# EAGLE design hail-met-v1 (EAGLE 7.1.0)
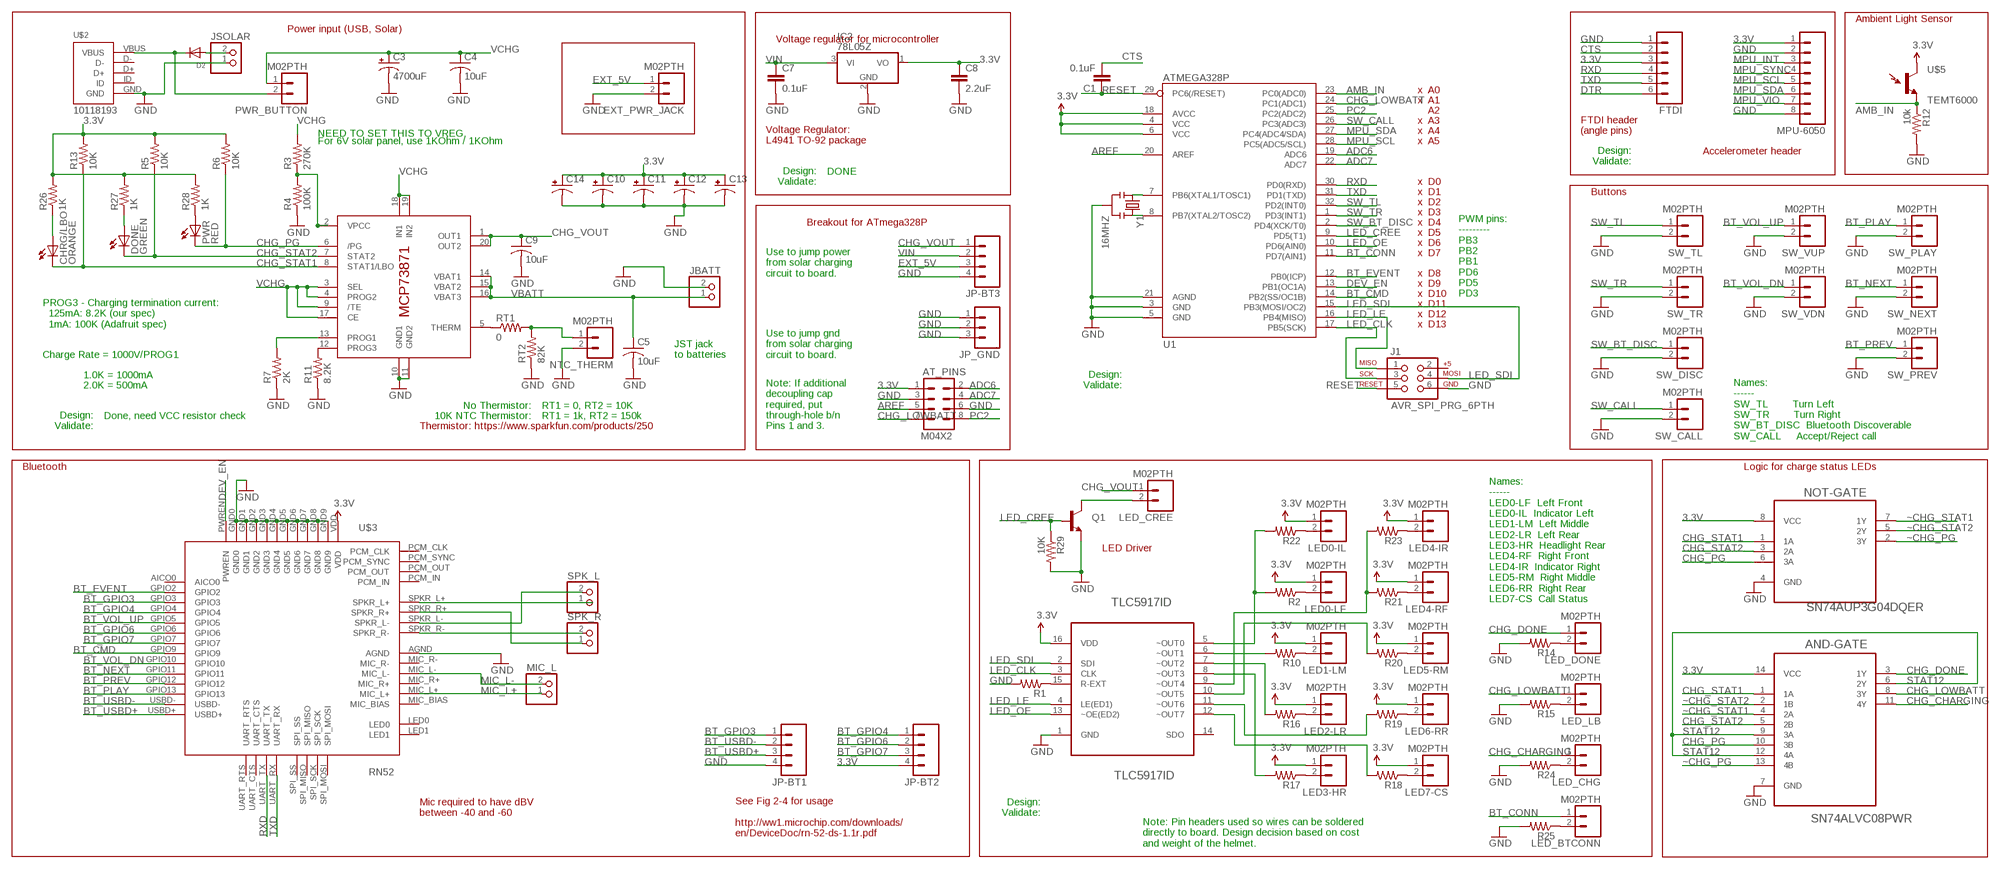
[diagram p0: schematic, sheet 1]

## Parts
AND-GATE  SN74ALVC08PWR  [SOP65P640X120-14N]
AT_PINS  M04X2  [2X4]
C1  0.1uF  CAP0805  [0805]
C3  4700uF  CPOL-USE5-13  [E5-13]
C4  10uF  C-USC0805K  [C0805K]
C5  10uF  C-USC0805K  [C0805K]
C7  0.1uF  CAP0805  [0805]
C8  2.2uF  CAP0805  [0805]
C9  10uF  C-USC0805K  [C0805K]
C10  CAP_POLPTH1  [CPOL-RADIAL-100UF-25V]
C11  CAP_POLPTH1  [CPOL-RADIAL-100UF-25V]
C12  CAP_POLPTH1  [CPOL-RADIAL-100UF-25V]
C13  CAP_POLPTH1  [CPOL-RADIAL-100UF-25V]
C14  CAP_POLPTH1  [CPOL-RADIAL-100UF-25V]
CHRG/LBO  ORANGE  LEDCHIP-LED0805  [CHIP-LED0805]
D2  DIODESOD-123  [SOD-123]
DONE  GREEN  LEDCHIP-LED0805  [CHIP-LED0805]
EXT_PWR_JACK  M02PTH  [1X02]
FTDI  M06LOCK  [1X06_LOCK]
IC1  MCP73871  [QFN20]
IC2  78L05Z  [TO92]
J1  AVR_SPI_PRG_6PTH  [2X3]
JBATT  JST_2PIN-SMT  [JST-PH-2-SMT]
JP-BT1  M04LOCK  [1X04_LOCK]
JP-BT2  M04LOCK  [1X04_LOCK]
JP-BT3  M04LOCK  [1X04_LOCK]
JP_GND  M03LOCK  [1X03_LOCK]
JSOLAR  JST_2PIN-SMT  [JST-PH-2-SMT]
LED0-IL  M02PTH  [1X02]
LED0-LF  M02PTH  [1X02]
LED1-LM  M02PTH  [1X02]
LED2-LR  M02PTH  [1X02]
LED3-HR  M02PTH  [1X02]
LED4-IR  M02PTH  [1X02]
LED4-RF  M02PTH  [1X02]
LED5-RM  M02PTH  [1X02]
LED6-RR  M02PTH  [1X02]
LED7-CS  M02PTH  [1X02]
LED_BTCONN  M02PTH  [1X02]
LED_CHG  M02PTH  [1X02]
LED_CREE  M02PTH  [1X02]
LED_DONE  M02PTH  [1X02]
LED_LB  M02PTH  [1X02]
MIC_L  JST_2PIN-SMT  [JST-PH-2-SMT]
MPU-6050  M08LOCK  [1X08_LOCK]
NOT-GATE  SN74AUP3G04DQER  [SON35P100X140X40-8N]
NTC_THERM  M02PTH  [1X02]
PWR  RED  LEDCHIP-LED0805  [CHIP-LED0805]
PWR_BUTTON  M02PTH  [1X02]
Q1  TRANSISTOR_NPNSOT23-3  [SOT23-3]
R1  RESISTOR0805-RES  [0805]
R2  RESISTOR0805-RES  [0805]
R3  270K  RESISTOR0805-RES  [0805]
R4  100K  RESISTOR0805-RES  [0805]
R5  10K  RESISTOR0805-RES  [0805]
R6  10K  RESISTOR0805-RES  [0805]
R7  2K  RESISTOR0805-RES  [0805]
R10  RESISTOR0805-RES  [0805]
R11  8.2K  RESISTOR0805-RES  [0805]
R12  10k  RESISTOR0805-RES  [0805]
R13  10K  RESISTOR0805-RES  [0805]
R14  RESISTOR0805-RES  [0805]
R15  RESISTOR0805-RES  [0805]
R16  RESISTOR0805-RES  [0805]
R17  RESISTOR0805-RES  [0805]
R18  RESISTOR0805-RES  [0805]
R19  RESISTOR0805-RES  [0805]
R20  RESISTOR0805-RES  [0805]
R21  RESISTOR0805-RES  [0805]
R22  RESISTOR0805-RES  [0805]
R23  RESISTOR0805-RES  [0805]
R24  RESISTOR0805-RES  [0805]
R25  RESISTOR0805-RES  [0805]
R26  1K  RESISTOR0805-RES  [0805]
R27  1K  RESISTOR0805-RES  [0805]
R28  1K  RESISTOR0805-RES  [0805]
R29  10K  RESISTOR0805-RES  [0805]
RT1  0  RESISTOR0805-RES  [0805]
RT2  82K  RESISTOR0805-RES  [0805]
SPK_L  JST_2PIN-SMT  [JST-PH-2-SMT]
SPK_R  JST_2PIN-SMT  [JST-PH-2-SMT]
SW_CALL  M02PTH  [1X02]
SW_DISC  M02PTH  [1X02]
SW_NEXT  M02PTH  [1X02]
SW_PLAY  M02PTH  [1X02]
SW_PREV  M02PTH  [1X02]
SW_TL  M02PTH  [1X02]
SW_TR  M02PTH  [1X02]
SW_VDN  M02PTH  [1X02]
SW_VUP  M02PTH  [1X02]
TLC5917ID  TLC5917ID  [SOIC127P600X175-16N]
U1  ATMEGA328P  ATMEGA328_SMT  [TQFP32-08]
U$2  10118193  [10118193]
U$3  RN52  [RN52]
U$5  TEMT6000  [TEMT6000-SEN]
Y1  16MHZ  RESONATOR16MHZ  [RESONATOR-SMD]

## Nets
3.3V: AND-GATE.14(VCC) AT_PINS.1 C8.1 C10.1(+) C11.1(+) C12.1(+) C13.1(+) C14.1(+) FTDI.3 IC2.1(VO) JP-BT2.4 LED0-IL.1 LED0-LF.1 LED1-LM.1 LED2-LR.1 LED3-HR.1 LED4-IR.1 LED4-RF.1 LED5-RM.1 LED6-RR.1 LED7-CS.1 MPU-6050.1 NOT-GATE.8(VCC) R5.2 R6.2 R13.2 R26.2 R27.2 R28.2 TLC5917ID.16(VDD) U1.4(VCC) U1.6(VCC) U1.18(AVCC) U$3.VDD U$5.COLLECTOR(C1)
ADC6: AT_PINS.2 U1.19(ADC6)
ADC7: AT_PINS.4 U1.22(ADC7)
AMB_IN: R12.1 U1.23(PC0(ADC0)) U$5.EMITTER(E1)
AREF: AT_PINS.5 U1.20(AREF)
BT_CMD: U1.14(PB2(SS/OC1B)) U$3.GPIO9
BT_CONN: LED_BTCONN.1 U1.11(PD7(AIN1))
BT_EVENT: U1.12(PB0(ICP)) U$3.GPIO2
BT_GPIO3: JP-BT1.1 U$3.GPIO3
BT_GPIO4: JP-BT2.1 U$3.GPIO4
BT_GPIO6: JP-BT2.2 U$3.GPIO6
BT_GPIO7: JP-BT2.3 U$3.GPIO7
BT_NEXT: SW_NEXT.1 U$3.GPIO11
BT_PLAY: SW_PLAY.1 U$3.GPIO13
BT_PREV: SW_PREV.1 U$3.GPIO12
BT_USBD+: JP-BT1.3 U$3.USBD+
BT_USBD-: JP-BT1.2 U$3.USBD-
BT_VOL_DN: SW_VDN.1 U$3.GPIO10
BT_VOL_UP: SW_VUP.1 U$3.GPIO5
CHG_CHARGING: AND-GATE.11(4Y) LED_CHG.1
CHG_DONE: AND-GATE.3(1Y) LED_DONE.1
CHG_LOWBATT: AND-GATE.8(3Y) AT_PINS.7 LED_LB.1 U1.24(PC1(ADC1))
CHG_PG: AND-GATE.10(3B) IC1.6(/PG) NOT-GATE.6(3A) PWR.C R6.1
CHG_STAT1: AND-GATE.1(1A) CHRG/LBO.C IC1.8(STAT1/LBO) NOT-GATE.1(1A) R13.1
CHG_STAT2: AND-GATE.5(2B) DONE.C IC1.7(STAT2) NOT-GATE.3(2A) R5.1
CHG_VOUT: C9.1 IC1.1(OUT1) IC1.20(OUT2) JP-BT3.1 LED_CREE.1
CTS: C1.2 FTDI.2
DEV_EN: U1.13(PB1(OC1A)) U$3.PWREN
DTR: FTDI.6
EXT_5V: EXT_PWR_JACK.1 JP-BT3.3
GND: AND-GATE.7(GND) AT_PINS.3 AT_PINS.6 C3.- C4.2 C5.2 C7.2 C8.2 C9.2 C10.2(-) C11.2(-) C12.2(-) C13.2(-) C14.2(-) EXT_PWR_JACK.2 FTDI.1 IC1.10(GND1) IC1.11(GND2) IC2.2(GND) J1.6 JBATT.2 JP-BT1.4 JP-BT3.4 JP_GND.1 JP_GND.2 JP_GND.3 JSOLAR.1 MPU-6050.2 MPU-6050.8 NOT-GATE.4(GND) NTC_THERM.2 Q1.2(E) R1.2 R4.1 R7.1 R11.1 R12.2 R14.2 R15.2 R24.2 R25.2 R29.2 RT2.1 SW_CALL.2 SW_DISC.2 SW_NEXT.2 SW_PLAY.2 SW_PREV.2 SW_TL.2 SW_TR.2 SW_VDN.2 SW_VUP.2 TLC5917ID.1(GND) U1.3(GND) U1.5(GND) U1.21(AGND) U$2.GND U$3.AGND U$3.GND0 U$3.GND1 U$3.GND2 U$3.GND3 U$3.GND4 U$3.GND5 U$3.GND6 U$3.GND7 U$3.GND8 U$3.GND9 Y1.2
LED_CLK: J1.3 TLC5917ID.3(CLK) U1.17(PB5(SCK))
LED_CREE: Q1.1(B) R29.1 U1.9(PD5(T1))
LED_LE: J1.1 TLC5917ID.4(LE(ED1)) U1.16(PB4(MISO))
LED_OE: TLC5917ID.13(~OE(ED2)) U1.10(PD6(AIN0))
LED_SDI: J1.4 TLC5917ID.2(SDI) U1.15(PB3(MOSI/OC2))
MIC_L+: MIC_L.1 U$3.MIC_L+
MIC_L-: MIC_L.2 U$3.MIC_L-
MPU_INT: MPU-6050.3
MPU_SCL: MPU-6050.5 U1.28(PC5(ADC5/SCL))
MPU_SDA: MPU-6050.6 U1.27(PC4(ADC4/SDA))
MPU_SYNC: MPU-6050.4
MPU_VIO: MPU-6050.7
N$1: U1.7(PB6(XTAL1/TOSC1)) Y1.1
N$2: U1.8(PB7(XTAL2/TOSC2)) Y1.3
N$3: IC1.5(THERM) RT1.1
N$5: R2.2 R22.2 TLC5917ID.5(~OUT0)
N$6: R10.2 TLC5917ID.6(~OUT1)
N$7: R16.2 TLC5917ID.7(~OUT2)
N$8: R17.2 TLC5917ID.8(~OUT3)
N$9: R21.2 R23.2 TLC5917ID.9(~OUT4)
N$10: R20.2 TLC5917ID.10(~OUT5)
N$11: R19.2 TLC5917ID.11(~OUT6)
N$12: R18.2 TLC5917ID.12(~OUT7)
N$13: NTC_THERM.1 RT1.2 RT2.2
N$14: SPK_L.2 U$3.SPKR_L-
N$15: D2.A JSOLAR.2
N$16: LED_BTCONN.2 R25.1
N$17: IC1.2(VPCC) R3.1 R4.2
N$18: IC1.12(PROG3) R11.2
N$19: LED_CREE.2 Q1.3(C)
N$20: CHRG/LBO.A R26.1
N$21: DONE.A R27.1
N$22: LED_DONE.2 R14.1
N$23: PWR.A R28.1
N$24: LED_LB.2 R15.1
N$25: U$3.SPKR_L+
N$26: SPK_R.2 U$3.SPKR_R-
N$27: SPK_R.1 U$3.SPKR_R+
N$30: LED_CHG.2 R24.1
N$56: R1.1 TLC5917ID.15(R-EXT)
N$57: LED0-LF.2 R2.1
N$58: LED4-RF.2 R21.1
N$59: LED5-RM.2 R20.1
N$60: LED6-RR.2 R19.1
N$61: LED7-CS.2 R18.1
N$62: LED3-HR.2 R17.1
N$63: LED1-LM.2 R10.1
N$64: LED2-LR.2 R16.1
N$65: LED0-IL.2 R22.1
N$66: LED4-IR.2 R23.1
N$80: D2.C PWR_BUTTON.2 U$2.VBUS
PC2: AT_PINS.8 U1.25(PC2(ADC2))
PROG1: IC1.13(PROG1) R7.2
RESET: C1.1 J1.5 U1.29(PC6(/RESET))
RXD: FTDI.4 U1.30(PD0(RXD)) U$3.UART_TX
STAT12: AND-GATE.6(2Y) AND-GATE.9(3A) AND-GATE.12(4A)
SW_BT_DISC: SW_DISC.1 U1.2(PD4(XCK/T0))
SW_CALL: SW_CALL.1 U1.26(PC3(ADC3))
SW_TL: SW_TL.1 U1.32(PD2(INT0))
SW_TR: SW_TR.1 U1.1(PD3(INT1))
TXD: FTDI.5 U1.31(PD1(TXD)) U$3.UART_RX
VBATT: C5.1 IC1.14(VBAT1) IC1.15(VBAT2) IC1.16(VBAT3) JBATT.1
VCHG: C3.+ C4.1 IC1.3(SEL) IC1.4(PROG2) IC1.9(/TE) IC1.17(CE) IC1.18(IN1) IC1.19(IN2) PWR_BUTTON.1 R3.2
VIN: C7.1 IC2.3(VI) JP-BT3.2
~CHG_PG: AND-GATE.13(4B) NOT-GATE.2(3Y)
~CHG_STAT1: AND-GATE.4(2A) NOT-GATE.7(1Y)
~CHG_STAT2: AND-GATE.2(1B) NOT-GATE.5(2Y)
Unconnected: J1.2 SPK_L.1 TLC5917ID.14(SDO) U$2.D+ U$2.D- U$2.ID U$3.AICO0 U$3.LED0 U$3.LED1 U$3.MIC_BIAS U$3.MIC_R+ U$3.MIC_R- U$3.PCM_CLK U$3.PCM_IN U$3.PCM_OUT U$3.PCM_SYNC U$3.SPI_MISO U$3.SPI_MOSI U$3.SPI_SCK U$3.SPI_SS U$3.UART_CTS U$3.UART_RTS

## Notes on the sheet
- Ambient Light Sensor
- Power input (USB, Solar)
- Voltage regulator for microcontroller
- x | A0
- x | A1
- A2
- x | A3
- x | A4
- FTDI header
  (angle pins)
- NEED TO SET THIS TO VREG.
  For 6V solar panel, use 1KOhm / 1KOhm
- x | A5
- Voltage Regulator:
  L4941 TO-92 package
- Accelerometer header
- Design:
  Validate:
- DONE
- Design:
  Validate:
- x | D0
- x | D1 | Buttons
- x | D2
- x | D3
- Breakout for ATmega328P | x | D4
- x | D5
- x | D6
- x | D7
- Use to jump power
  from solar charging
  circuit to board.
- x | D8
- x | D9
- x | D10
- PWM pins:
  ---------
  PB3
  PB2
  PB1
  PD6
  PD5
  PD3
- x | D11
- x | D12
- PROG3 - Charging termination current: 
    125mA: 8.2K (our spec)
    1mA: 100K (Adafruit spec)
- x | D13
- Charge Rate = 1000V/PROG1
- JST jack
  to batteries
- Use to jump gnd
  from solar charging
  circuit to board.
- 1.0K = 1000mA
- 2.0K = 500mA
- Design:
  Validate:
- No Thermistor: | RT1 = 0, RT2 = 10K
- Done, need VCC resistor check | 10K NTC Thermistor: | RT1 = 1k, RT2 = 150k
- Design:
  Validate:
- Thermistor: https://www.sparkfun.com/products/250
- Note: If additional
  decoupling cap
  required, put
  through-hole b/n
  Pins 1 and 3.
- Names:
  ------
  SW_TL        Turn Left
  SW_TR        Turn Right
  SW_BT_DISC  Bluetooth Discoverable
  SW_CALL     Accept/Reject call
- Bluetooth | Logic for charge status LEDs
- LED Driver
- Names:
  ------
  LED0-LF  Left Front
  LED0-IL  Indicator Left
  LED1-LM  Left Middle
  LED2-LR  Left Rear
  LED3-HR  Headlight Rear
  LED4-RF  Right Front
  LED4-IR  Indicator Right
  LED5-RM  Right Middle
  LED6-RR  Right Rear
  LED7-CS  Call Status
- Mic required to have dBV
  between -40 and -60
- Design:
  Validate:
- See Fig 2-4 for usage
  
  http://ww1.microchip.com/downloads/
  en/DeviceDoc/rn-52-ds-1.1r.pdf
- Note: Pin headers used so wires can be soldered
  directly to board. Design decision based on cost
  and weight of the helmet.

## Library data of the parts
AND-GATE = Texas Instruments_By_element14_Batch_1:SN74ALVC08PWR: QUADRUPLE 2-INPUT POSITIVE-AND GATE; MPN: SN74ALVC08PWR; OC_FARNELL: 1607810; OC_NEWARK: 97B9367; PACKAGE: TSSOP-14; SUPPLIER: Texas Instruments
AT_PINS = SparkFun-Connectors:M04X2: .1" header, two rows of four.
C1 C7 C8 = SparkFun-Passives:CAP: Capacitor Standard 0603 ceramic capacitor, and 0.1" leaded capacitor.
C3 = rcl:CPOL-US: POLARIZED CAPACITOR, American symbol
C4 C9 = adafruit:C-US: CAPACITOR, American symbol
C5 = rcl:C-US: CAPACITOR, American symbol
C10-C14 = SparkFun-Capacitors:CAP_POL: Capacitor Polarized These are standard SMD and PTH capacitors. Normally 10uF, 47uF, and 100uF in electrolytic and tantalum varieties. Always verify the external diameter of the through hole cap, it varies with capacity, voltage, and manufacturer. The EIA devices should be standard.
CHRG/LBO DONE PWR = adafruit:LED: LED OSRAM: - CHIPLED LG R971, LG N971, LY N971, LG Q971, LY Q971, LO R971, LY R971 LH N974, LH R974 LS Q976, LO Q976, LY Q976 LO Q996 - Hyper CHIPLED LW Q18S LB Q993, LB Q99A, LB R99A - SideLED LS A670, LO A670, LY A670, LG A670, LP A670 LB A673, LV A673, LT A673, LW A673 LH A674 LY A675 LS A676, LA A676, LO A676, LY A676, LW A676 LS A679, LY A679, LG A679 - Hyper Micro SIDELED® LS Y876, LA Y876, LO Y876, LY Y876 LT Y87S - SmartLED LW L88C, LW L88S LB L89C, LB L89S, LG L890 LS L89K, LO L89K, LY L89K LS L896, LA L896, LO L896, LY L896 - TOPLED LS T670, LO T670, LY T670, LG T670, LP T670 LSG T670, LSP T670, LSY T670, LOP T670, LYG T670 LG T671, LOG T671, LSG T671 LB T673, LV T673, LT T673, LW T673 LH T674 LS T676, LA T676, LO T676, LY T676, LB T676, LH T676, LSB T676, LW T676 LB T67C, LV T67C, LT T67C, LS T67K, LO T67K, LY T67K, LW E67C LS E67B, LA E67B, LO E67B, LY E67B, LB E67C, LV E67C, LT E67C LW T67C LS T679, LY T679, LG T679 LS T770, LO T770, LY T770, LG T770, LP T770 LB T773, LV T773, LT T773, LW T773 LH T774 LS E675, LA E675, LY E675, LS T675 LS T776, LA T776, LO T776, LY T776, LB T776 LHGB T686 LT T68C, LB T68C - Hyper Mini TOPLED® LB M676 - Mini TOPLED Santana® LG M470 LS M47K, LO M47K, LY M47K Source: http://www.osram.convergy.de/
D2 = adafruit:DIODE: Diode SMADIODE - SMA Surface Mount Package 20V 1A Schottky Diode Digikey: 641-1014-6-ND DO-1N4148 - Through Hole Small Current Diode SOD-123 20V 1 A (.5mV Vf) Schottky Diode - Digikey: MBRX120TPMSCT-ND SOD-323 10V 570mA (.38mV Vf, 3ns) Schottky Diode - Digikey: ZLLS410CT-ND SOD-523 30V 30mA Schottky Diode (RB751S-40TE61) - Digikey: RB751S-40TE61CT-ND SOT23-R/W - SOT23 Package (R = Solder Paste/Reflow Ovens, W = Hand-Soldering) BAT54Film 40V 300mA - Digikey: 497-7162-1-ND
EXT_PWR_JACK LED0-IL LED0-LF LED1-LM LED2-LR LED3-HR LED4-IR LED4-RF LED5-RM LED6-RR LED7-CS LED_BTCONN LED_CHG LED_CREE LED_DONE LED_LB NTC_THERM PWR_BUTTON SW_CALL SW_DISC SW_NEXT SW_PLAY SW_PREV SW_TL SW_TR SW_VDN SW_VUP = SparkFun-Connectors:M02: Standard 2-pin 0.1" header. Use with - straight break away headers ( PRT-00116) - right angle break away headers (PRT-00553) - swiss pins (PRT-00743) - machine pins (PRT-00117) - female headers (PRT-00115) Molex polarized connector foot print use with: PRT-08233 with associated crimp pins and housings. 2.54_SCREWTERM for use with PRT-10571. 3.5mm Screw Terminal footprints for PRT-08084 5mm Screw Terminal footprints for use with PRT-08432
FTDI = SparkFun-Connectors:M06: Header 6 Standard 6-pin 0.1" header. Use with straight break away headers (SKU : PRT-00116), right angle break away headers (PRT-00553), swiss pins (PRT-00743), machine pins (PRT-00117), and female headers (PRT-00115). Molex polarized connector foot print use with SKU : PRT-08094 with associated crimp pins and housings. NOTES ON THE VARIANTS LOCK and LOCK_LONGPADS... This footprint was designed to help hold the alignment of a through-hole component (i.e. 6-pin header) while soldering it into place. You may notice that each hole has been shifted either up or down by 0.005 of an inch from it's more standard position (which is a perfectly straight line). This slight alteration caused the pins (the squares in the middle) to touch the edges of the holes. Because they are alternating, it causes a "brace" to hold the component in place. 0.005 has proven to be the perfect amount of "off-center" position when using our standard breakaway headers. Although looks a little odd when you look at the bare footprint, once you have a header in there, the alteration is very hard to notice. Also,if you push a header all the way into place, it is covered up entirely on the bottom side. This idea of altering the position of holes to aid alignment will be further integrated into the Sparkfun Library for other footprints. It can help hold any component with 3 or more connection pins.
IC1 = adafruit:MCP73871
IC2 = adafruit:78*: Positive VOLTAGE REGULATOR Added bigger pads to the TO-92 package
J1 = SparkFun-Connectors:AVR_SPI_PRG_6: AVR ISP 6 Pin This is the reduced ISP connector for AVR programming. Common on Arduino. This footprint will take up less PCB space and can be used with a 10-pin to 6-pin adapter such as SKU: BOB-08508 **Special note about "TEST_POINT" package. The stop mask is on the top side, so if you want your programming test points to be on the bottom of your board, make sure to place this package on the bottom side of the board. This also ensure that the orientation to program from the bottom side will be correct.
JBATT JSOLAR MIC_L SPK_L SPK_R = adafruit:JST_2PIN: JST 2-Pin Connectors of various flavors SMT-RA (S2B-PH-SM4) 4UConnector #17311 SMT (B2B-PH-SM4) THM-RA (S2B-PH) THM (B2B-PH)
JP-BT1-JP-BT3 = SparkFun-Connectors:M04: Header 4 Standard 4-pin 0.1" header. Use with straight break away headers (SKU : PRT-00116), right angle break away headers (PRT-00553), swiss pins (PRT-00743), machine pins (PRT-00117), and female headers (PRT-00115). Molex polarized connector foot print use with SKU : PRT-08231 with associated crimp pins and housings. 1MM SMD Version SKU: PRT-10208
JP_GND = SparkFun-Connectors:M03: Header 3 Standard 3-pin 0.1" header. Use with straight break away headers (SKU : PRT-00116), right angle break away headers (PRT-00553), swiss pins (PRT-00743), machine pins (PRT-00117), and female headers (PRT-00115). Molex polarized connector foot print use with SKU : PRT-08232 with associated crimp pins and housings.
MPU-6050 = SparkFun-Connectors:M08: Header 8 Standard 8-pin 0.1" header. Use with straight break away headers (SKU : PRT-00116), right angle break away headers (PRT-00553), swiss pins (PRT-00743), machine pins (PRT-00117), and female headers (PRT-00115).
NOT-GATE = Texas Instruments_By_element14_Batch_1:SN74AUP3G04DQER: LOW-POWER TRIPLE INVERTER GATE; MPN: SN74AUP3G04DQER; OC_FARNELL: -; OC_NEWARK: 64R0603; PACKAGE: SON-8; SUPPLIER: Texas Instruments
Q1 = SparkFun:TRANSISTOR_NPN: Transistor NPN BJT configuration in SOT23 package. MMBT2222 is the common NPN we use. Double check BCE configuration again layout.
R1-R7 R10-R29 RT1 RT2 = SparkFun-Passives:RESISTOR: Resistor Basic schematic elements and footprints for 0603, 1206, and PTH resistors.
TLC5917ID = Texas Instruments_By_element14_Batch_1:TLC5917ID: 8-CHANNEL CONSTANT-CURRENT LED SINK DRIVERS; MPN: TLC5917ID; OC_FARNELL: 1755251; OC_NEWARK: 50M9008; PACKAGE: SOIC-16; SUPPLIER: Texas Instruments
U1 = SparkFun-DigitalIC:ATMEGA328_SMT: 32-Pin Atmega328 part Commonly used on Arduino compatible boards Available in QFP and QFN packages TQFP is IC-09069 QFN is non-stock; PROD_ID: IC-09069
U$2 = MicroUSB:10118193: Micro USB B Jack for Surface Mount; MPN: 10118193; OC_DIGIKEY: 609-4616-1-ND; WEBSITE: http://www.digikey.com/product-detail/en/10118193-0001LF/609-4616-1-ND/2785380
U$3 = RN52:RN52: RN-52 Bluetooth Module; DIGIKEY_OC: RN52-I/RM-ND
U$5 = SparkFun:TEMT6000: Ambient Light Sensor Simple light detection sensor. Output varies with light intensity input. Spark Fun Electronics SKU : COM-08348
Y1 = SparkFun-FreqCtrl:RESONATOR: Resonator Small SMD resonator. Used, eg, on the Arduino Pro/ Pro Mini boards. 8MHz- XTAL-08895 16MHz- XTAL-08900; PROD_ID: XTAL-08900

## Board
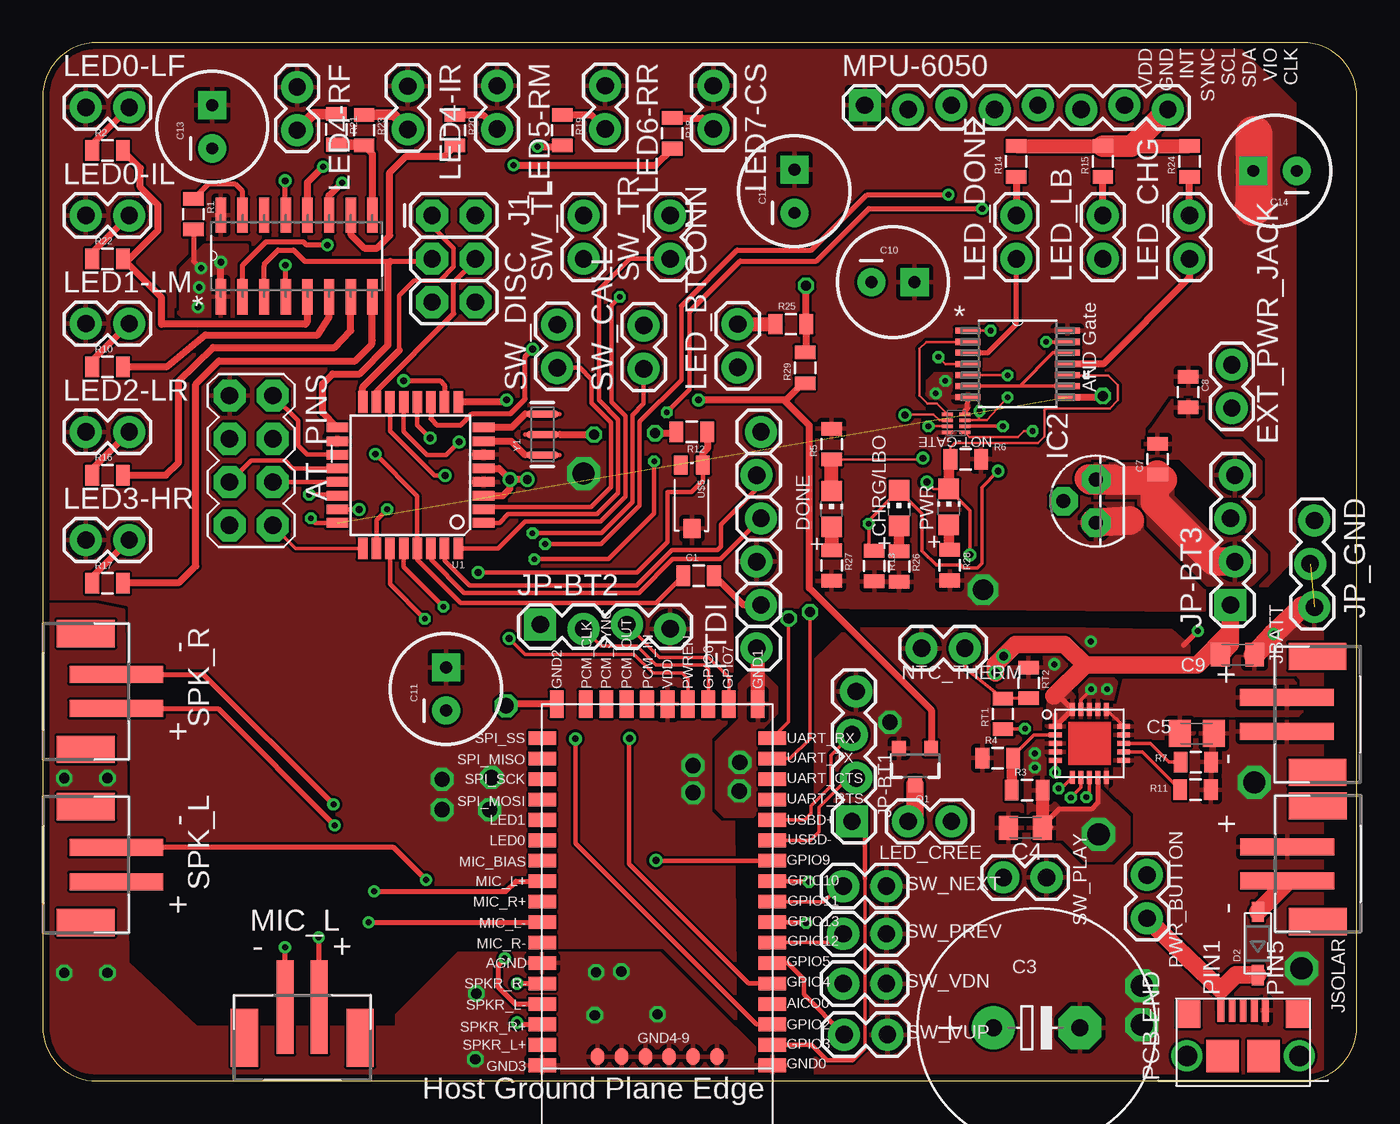
[diagram p1: board, top side]
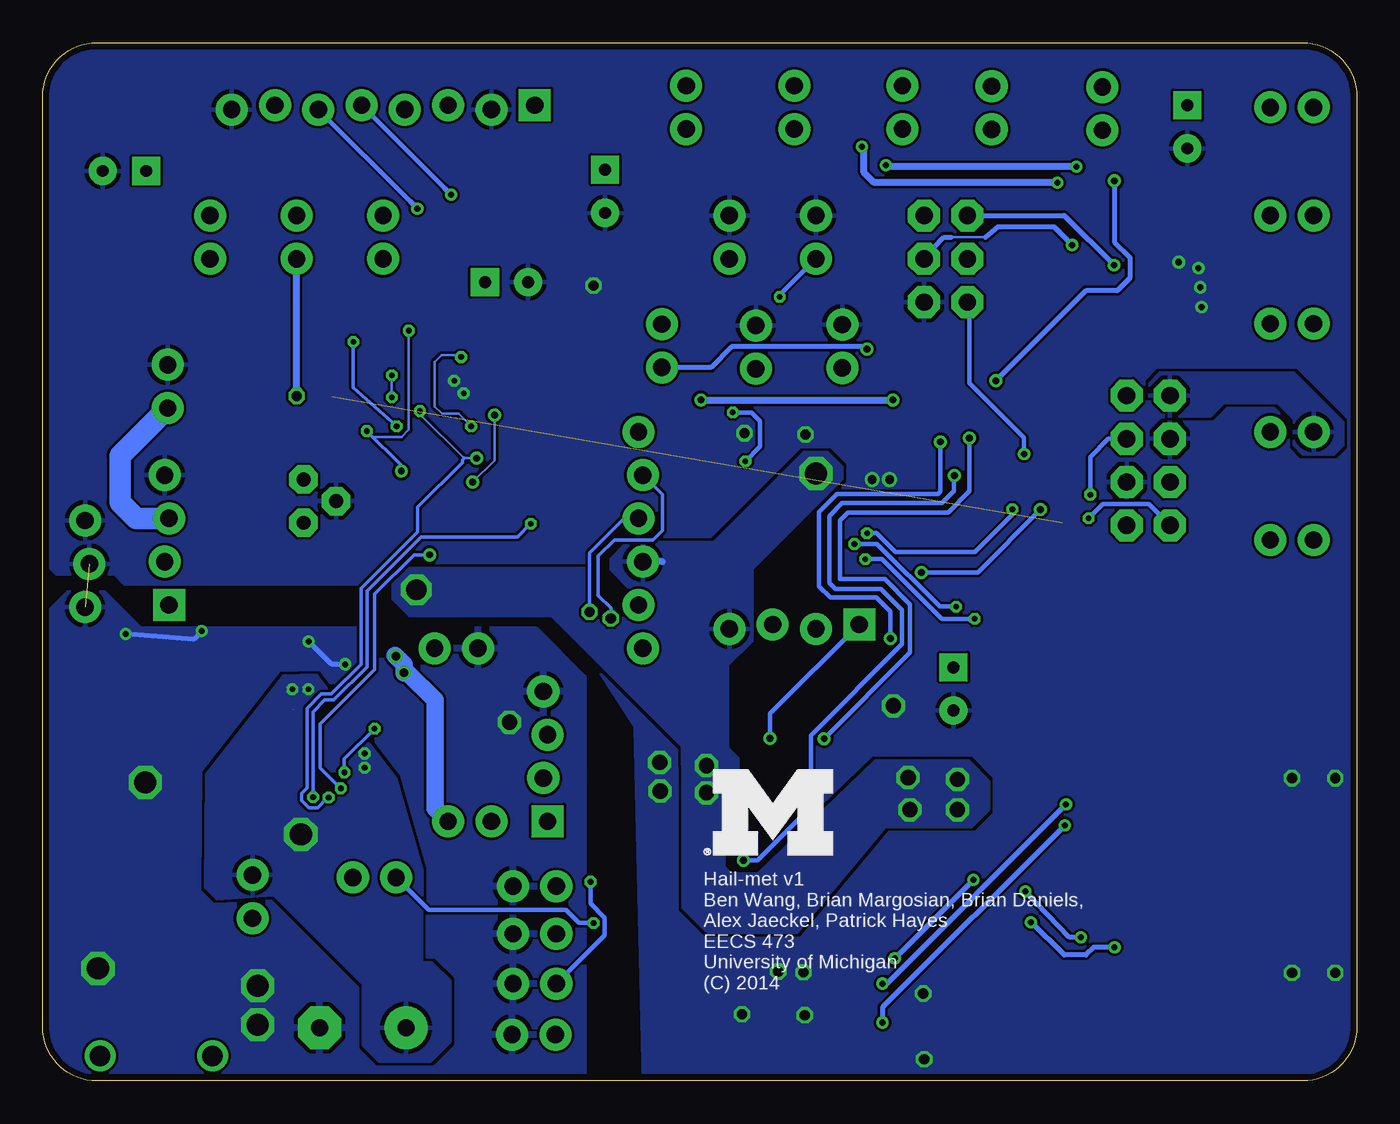
[diagram p2: board, bottom side, seen from below]

Size 77.14 x 60.95 mm. Coordinates in mm from the lower left corner, seen from the top.
Outline: 0,57.77 0,3.17 arc90 3.17,0 73.97,0 arc90 77.14,3.17 77.14,57.77 arc90 73.97,60.95 3.17,60.95 arc90 0,57.77
Copper layers (1*16): Top 0.0356mm / dielectric 1.5011mm / Bottom 0.0356mm
Design rules "LaenPCBOrder *": minimum track width 6mil, minimum drill 13mil, track to track 6mil, track to pad 6mil, pad to pad 6mil, via to via 6mil, smd to smd 6mil, copper to edge 15mil, drill to drill 6mil, minimum pad ring 7mil, minimum via ring 7mil, stop-mask expansion 3mil, vias tented up to drill 0mil, thermal gap 10mil

### Footprints (pad centres in the part's own frame; a part is rotated, then mirrored left to right if it is on the bottom)
SOP65P640X120-14N = smd 1.473 x 0.356: 1 -2.921,1.956; 2 -2.921,1.295; 3 -2.921,0.66; 4 -2.921,0; 5 -2.921,-0.66; 6 -2.921,-1.295; 7 -2.921,-1.956; 8 2.921,-1.956; 9 2.921,-1.295; 10 2.921,-0.66; 11 2.921,0; 12 2.921,0.66; 13 2.921,1.295; 14 2.921,1.956
2X4 = drill 1.016 pad 1.88 octagon: 1 -3.81,-1.27; 2 -3.81,1.27; 3 -1.27,-1.27; 4 -1.27,1.27; 5 1.27,-1.27; 6 1.27,1.27; 7 3.81,-1.27; 8 3.81,1.27
0805 = smd 0.8 x 1.2: 1 -0.9,0; 2 0.9,0
E5-13 = drill 1.016 pad 2.54: + -2.54,0 | drill 1.016 pad 2.54 octagon: - 2.54,0
C0805K = smd 1.1 x 1.4: 1 -1,0; 2 1,0
C0805K' = smd 1.3 x 1.6: 1 -1,0; 2 1,0
CPOL-RADIAL-100UF-25V = drill 0.7 pad 1.651 square: 1 1.27,0 | drill 0.7 pad 1.651: 2 -1.27,0
CHIP-LED0805 = smd 1.2 x 1.2: A 0,-1.05; C 0,1.05
SOD-123 = smd 1.2 x 0.7: A 1.85,0; C -1.85,0
1X02 = drill 1.016 pad 1.88: 1 0,0; 2 2.54,0
1X06_LOCK = drill 1.016 pad 1.88: 1 0,0; 2 2.54,-0.254; 3 5.08,0; 4 7.62,-0.254; 5 10.16,0; 6 12.7,-0.254
QFN20 = smd 0.75 x 0.3: 1 -2,1; 2 -2,0.5; 3 -2,0; 4 -2,-0.5; 5 -2,-1; 11 2,-1; 12 2,-0.5; 13 2,0; 14 2,0.5; 15 2,1 | smd 0.3 x 0.75: 6 -1,-2; 7 -0.5,-2; 8 0,-2; 9 0.5,-2; 10 1,-2; 16 1,2; 17 0.5,2; 18 0,2; 19 -0.5,2; 20 -1,2
TO92 = drill 0.813 pad 1.676 octagon: 1 -1.27,0; 2 0,1.905; 3 1.27,0
2X3 = drill 1.016 pad 1.88 octagon: 1 0,0; 2 0,2.54; 3 2.54,0; 4 2.54,2.54; 5 5.08,0; 6 5.08,2.54
JST-PH-2-SMT = smd 1 x 5.5: 1 -1,-1.8; 2 1,-1.8 | smd 1.6 x 3.4: NC1 -3.4,0; NC2 3.4,0
1X04_LOCK = drill 1.016 pad 1.88 square: 1 0,0.127 | drill 1.016 pad 1.88: 2 2.54,-0.127; 3 5.08,0.127; 4 7.62,-0.127
1X03_LOCK = drill 1.016 pad 1.88: 1 0,0.127; 2 2.54,-0.127; 3 5.08,0.127
1X08_LOCK = drill 1.016 pad 1.88 square: 1 0,0.127 | drill 1.016 pad 1.88: 2 2.54,-0.127; 3 5.08,0.127; 4 7.62,-0.127; 5 10.16,0.127; 6 12.7,-0.127; 7 15.24,0.127; 8 17.78,-0.127
SON35P100X140X40-8N = smd 0.66 x 0.203: 1 -0.508,0.533; 2 -0.508,0.178; 3 -0.508,-0.178; 4 -0.508,-0.533; 5 0.508,-0.533; 6 0.508,-0.178; 7 0.508,0.178; 8 0.508,0.533
SOT23-3 = smd 0.8 x 0.9: 1 -0.95,-1; 2 0.95,-1; 3 0,1.1
SOIC127P600X175-16N = smd 2.057 x 0.61: 1 -4.801,8.89; 2 -4.801,7.62; 3 -4.801,6.35; 4 -4.801,5.08; 5 -4.801,3.81; 6 -4.801,2.54; 7 -4.801,1.27; 8 -4.801,0; 9 0,0; 10 0,1.27; 11 0,2.54; 12 0,3.81; 13 0,5.08; 14 0,6.35; 15 0,7.62; 16 0,8.89
TQFP32-08 = smd 1.27 x 0.559: 1 -4.293,2.8; 2 -4.293,2; 3 -4.293,1.2; 4 -4.293,0.4; 5 -4.293,-0.4; 6 -4.293,-1.2; 7 -4.293,-2; 8 -4.293,-2.8; 17 4.293,-2.8; 18 4.293,-2; 19 4.293,-1.2; 20 4.293,-0.4; 21 4.293,0.4; 22 4.293,1.2; 23 4.293,2; 24 4.293,2.8 | smd 0.559 x 1.27: 9 -2.8,-4.293; 10 -2,-4.293; 11 -1.2,-4.293; 12 -0.4,-4.293; 13 0.4,-4.293; 14 1.2,-4.293; 15 2,-4.293; 16 2.8,-4.293; 25 2.8,4.293; 26 2,4.293; 27 1.2,4.293; 28 0.4,4.293; 29 -0.4,4.293; 30 -1.2,4.293; 31 -2,4.293; 32 -2.8,4.293
10118193 = smd 0.4 x 1.35: D+ 0,2.675; D- -0.65,2.675; GND 1.3,2.675; ID 0.65,2.675; VBUS -1.3,2.675 | smd 1.4 x 1.6: P$6 -3.2,2.45; P$7 3.2,2.45 | smd 1.9 x 1.9: P$8 1.2,0; P$9 -1.2,0 | drill 1.2 pad 1.6: P$11 3.3,0; P$12 -3.3,0
RN52 = smd 1.6 x 0.8: AGND 13.5,15.2; AICO0 0,17.6; GND0 0,21.2; GND3 13.5,21.2; GPIO2 0,18.8; GPIO3 0,20; GPIO4 0,16.4; GPIO5 0,15.2; GPIO9 0,9.2; GPIO10 0,10.4; GPIO11 0,11.6; GPIO12 0,14; GPIO13 0,12.8; LED0 13.5,8; LED1 13.5,6.8; MIC_BIAS 13.5,9.2; MIC_L+ 13.5,10.4; MIC_L- 13.5,12.8; MIC_R+ 13.5,11.6; MIC_R- 13.5,14; SPI_MISO 13.5,3.2; SPI_MOSI 13.5,5.6; SPI_SCK 13.5,4.4; SPI_SS 13.5,2; SPKR_L+ 13.5,20; SPKR_L- 13.5,17.6; SPKR_R+ 13.5,18.8; SPKR_R- 13.5,16.4; UART_CTS 0,4.4; UART_RTS 0,5.6; UART_RX 0,2; UART_TX 0,3.2; USBD+ 0,6.8; USBD- 0,8 | smd 0.8 x 1.6: GND1 0.85,0; GND2 12.65,0; GPIO6 3.75,0; GPIO7 2.55,0; PCM_CLK 10.95,0; PCM_IN 7.35,0; PCM_OUT 8.55,0; PCM_SYNC 9.75,0; PWREN 4.95,0; VDD 6.15,0 | smd 0.8 x 1: GND4 3.25,20.7; GND5 4.65,20.7; GND6 6.05,20.7; GND7 7.45,20.7; GND8 8.85,20.7; GND9 10.25,20.7
TEMT6000-SEN = smd 1.1 x 0.8: BASE -1.87,-0.65; EMITTER -1.87,0.65 | smd 1.1 x 1: COLLECTOR 1.86,0.01
RESONATOR-SMD = smd 0.45 x 1.905: 1 -1.2,0; 2 0,0; 3 1.2,0

### Placement (x,y rotation side)
AND-GATE  57.23,42.09 0 top
AT_PINS  12.24,36.42 270 top
C1  38.51,29.67 0 top
C3  58.34,3.12 0 top
C4  57.68,14.86 180 top
C5  10uF  [C0805K']  67.74,20.4 0 top
C7  65.43,36.5 90 top
C8  67.23,40.44 270 top
C9  70.13,25.02 0 top
C10  49.91,46.89 0 top
C11  23.67,23.01 90 top
C12  44.12,52.22 90 top
C13  9.96,56.01 90 top
C14  72.34,53.42 180 top
CHRG/LBO  50.27,33.63 0 top
D2  71.32,8.08 90 top
DONE  46.3,33.58 0 top
EXT_PWR_JACK  69.8,39.5 90 top
FTDI  41.91,25.4 90 top
IC1  61.44,19.81 0 top
IC2  61.82,34.04 90 top
J1  22.86,50.8 270 top
JBATT  74.83,21.51 270 top
JP-BT1  47.62,15.24 90 top
JP-BT2  29.21,26.67 0 top
JP-BT3  69.85,27.94 90 top
JP_GND  74.52,32.89 270 top
JSOLAR  74.85,12.75 270 top
LED0-IL  2.54,50.8 0 top
LED0-LF  2.54,57.15 0 top
LED1-LM  2.54,44.45 0 top
LED2-LR  2.54,38.1 0 top
LED3-HR  2.54,31.75 0 top
LED4-IR  21.44,58.39 270 top
LED4-RF  14.94,58.34 270 top
LED5-RM  26.67,58.42 270 top
LED6-RR  33.02,58.42 270 top
LED7-CS  39.37,58.42 270 top
LED_BTCONN  40.79,41.88 90 top
LED_CHG  67.31,48.26 90 top
LED_CREE  53.34,15.24 180 top
LED_DONE  57.15,48.26 90 top
LED_LB  62.23,48.26 90 top
MIC_L  15.24,2.54 180 top
MPU-6050  48.26,57.15 0 top
NOT-GATE  53.62,38.61 180 top
NTC_THERM  54.13,25.4 180 top
PWR  53.19,33.71 0 top
PWR_BUTTON  64.82,12.09 270 top
Q1  51.21,18.52 180 top
R1  8.86,50.88 270 top
R2  3.81,54.61 0 top
R3  57.78,17.07 0 top
R4  56.06,18.95 0 top
R5  46.3,37.39 90 top
R6  54.18,36.5 0 top
R7  67.69,18.72 180 top
R10  3.81,41.91 0 top
R11  67.67,17.09 180 top
R12  38.1,38.1 180 top
R13  48.82,30.23 270 top
R14  57.15,53.98 90 top
R15  62.23,53.98 90 top
R16  3.81,35.56 0 top
R17  3.81,29.21 0 top
R18  36.96,55.63 270 top
R19  30.51,55.8 270 top
R20  24.21,55.8 270 top
R21  17.25,55.85 270 top
R22  3.81,48.26 0 top
R23  18.87,55.8 270 top
R24  67.31,53.98 90 top
R25  43.92,44.42 0 top
R26  50.27,30.2 270 top
R27  46.3,30.25 270 top
R28  53.24,30.28 270 top
R29  44.75,41.86 90 top
RT1  56.36,21.54 90 top
RT2  57.86,23.37 270 top
SPK_L  2.54,12.7 90 top
SPK_R  2.54,22.86 90 top
SW_CALL  35.28,41.81 90 top
SW_DISC  30.2,41.86 90 top
SW_NEXT  46.99,11.43 0 top
SW_PLAY  56.39,11.94 0 top
SW_PREV  46.99,8.64 0 top
SW_TL  31.75,48.26 90 top
SW_TR  36.83,48.26 90 top
SW_VDN  46.99,5.71 0 top
SW_VUP  47.04,2.72 0 top
TLC5917ID  19.35,50.83 90 top
U1  21.59,35.56 180 top
U$2  70.46,1.47 0 top
U$3  42.82,22.12 180 top
U$5  38.1,34.29 270 top
Y1  29.34,37.95 90 top

### Tracks (layer width: path | path; a pad name or v marks a point on that pad's centre or on a via)
3.3V  (via drill 0.9, 1.2, 1.3)
  Top 1.676: 61.75,32.79 63.8,32.89
  Top 2.184: 71.09,55.55 71.09,51.33 71.04,51.28
  Bottom 0.406: 40.77,30.48 FTDI.3
  other vias: 23.44,17.7 26.24,15.93 38.18,18.52 38.18,16.92 23.44,15.93 26.34,17.81 31.75,35.66 55.19,28.83
  pour Top (rank 3): 40.41,27.89 68.15,27.64 68.4,60.88 -0.08,61.14 -0.08,-0.2 40.67,-0.2
  pour Bottom: 21.62,15.93 21.62,17.63 22.78,18.8 28.27,18.8 35.15,12.17 36.73,12.17 37.13,12.57 37.13,13.92 36.32,14.73 36.32,18.92 37.03,19.63 39.29,19.63 39.55,19.38 39.55,10.19 38.1,8.74 32.87,8.74 27.69,14.94 22.61,14.94
  pour Bottom: 8.61,39.04 11.56,39.04 12.17,39.65 12.17,40.94 11.56,41.55 3.71,41.55 0.84,38.68 0.84,37.31 1.35,36.8 3.17,36.8 3.68,37.31 3.68,38.86 4.65,39.83 7.8,39.83
  pour Bottom: 30.23,36.04 30.23,35.33 35.51,30.05 35.51,25.83 36.93,24.41 36.93,16.28 37.9,15.32 38.53,15.32 39.29,16.08 39.29,26.21 41.12,28.04 42.57,28.8 43.79,30.02 43.79,30.63 42.82,31.6 37.74,31.6 32.46,36.88 31.06,36.88
  pour Bottom: 55.88,29.92 56.59,29.21 56.59,28.27 55.63,27.3 47.29,27.3 39.6,19.61 39.6,18.62 38.66,17.68 37.62,17.68 37.19,18.11 37.19,19.84 38.51,21.16 38.51,25.55 43.05,30.1 55.68,30.1 55.7,30.1
  pour Top (rank 2): 67.28,61.24 69.67,61.24 73.53,57.38 73.53,30.68 71.91,29.06 60.4,29.06 58.98,27.64 58.98,58.62 61.54,61.19 61.59,61.24
ADC6
  Top 0.254: U1.19 15.51,36.76 14.99,37.29 14.99,38.76 AT_PINS.2
ADC7  (via drill 0.33)
  Top 0.254: v15.65,34.42 17.24,34.42 U1.22
  Bottom 0.254: AT_PINS.4 14.58,37.69 15.65,36.63 v15.65,34.42
AMB_IN  (via drill 0.41)
  Top 0.254: U1.23 v18.57,33.55 | v25.55,29.84 34.9,29.84 36.68,31.62 36.68,34.57 38.08,34.57 38.75,35.24 U$5.EMITTER
  Top 0.406: U$5.EMITTER 38.75,36.87 39.04,37.16 39.04,38.06 R12.1
  Bottom 0.254: v18.57,33.55 22.25,29.84 v25.55,29.84
AREF
  Top 0.254: U1.20 14.69,35.96 14.22,36.42 12.24,36.42 AT_PINS.5
BT_CMD  (via drill 0.41)
  Top 0.203: 36.02,12.92 v35.99,12.95
  Top 0.254: U$3.GPIO9 36.02,12.92 | v23.62,35.53 23.01,35.53 20.39,38.16 U1.14
  Bottom 0.203: 23.65,35.51 v23.62,35.53
  Bottom 0.254: v35.99,12.95 35.18,12.95 32.05,16.08 32.05,20.27 26.7,25.65 26.7,27.64 27.94,28.88 30.61,28.88 30.96,29.23 30.96,33.17 30.23,33.91 24.36,33.91 23.65,34.62 23.65,35.51
BT_CONN  (via drill 0.41)
  Top 0.305: U1.11 22.79,38.86 23.14,38.51 24.56,38.51 25.22,39.17 27.46,39.17 28.32,40.03 28.32,42.52 v28.75,42.95
  Bottom 0.305: v28.75,42.95 28.91,43.1 36.7,43.1 37.92,41.88 LED_BTCONN.1
BT_EVENT  (via drill 0.41)
  Top 0.254: v31.27,20.09 31.27,13.95 41.89,3.32 U$3.GPIO2 | v22.73,37.74 21.99,38.49 U1.12
  Bottom 0.203: 30.35,29.49 30.33,29.46
  Bottom 0.254: v31.27,20.09 26.24,25.15 26.24,27.96 27.71,29.46 30.33,29.46 | v22.73,37.74 22.73,34.62 23.98,33.38 29.87,33.38 30.35,32.89 30.35,29.49
BT_GPIO3
  Top 0.203: 48.23,1.93 48.26,1.96 48.26,11.86
  Top 0.254: JP-BT1.1 48.26,14.48 48.26,11.86 | U$3.GPIO3 45.12,2.12 46.02,1.22 47.52,1.22 48.23,1.93
BT_GPIO4  (via drill 0.41)
  Top 0.203: 34.42,20.09 v34.44,20.12
  Top 0.254: U$3.GPIO4 41.44,5.72 34.42,12.75 34.42,20.09
  Bottom 0.254: v34.44,20.12 34.44,21.57 JP-BT2.1
BT_GPIO6
  Top 0.203: U$3.GPIO6 39.07,24.17 38.84,24.41 35.99,24.41 34.87,25.53 32.77,25.53 JP-BT2.2
BT_GPIO7
  Top 0.203: U$3.GPIO7 40.27,23.68 39.09,24.87 36.22,24.87 JP-BT2.3
BT_NEXT
  Top 0.203: SW_NEXT.1 46.76,11.43 45.85,10.52 U$3.GPIO11
BT_PLAY  (via drill 0.33)
  Top 0.254: v44.81,9.27 44.75,9.32 U$3.GPIO13
  Bottom 0.254: v44.81,9.27 45.64,9.27 46.41,10.03 54.48,10.03 SW_PLAY.1
BT_PREV
  Top 0.203: SW_PREV.1 46.49,8.12 U$3.GPIO12
BT_USBD+
  Top 0.203: U$3.USBD+ 44.74,15.32 45.11,15.7 45.11,16.15 46.28,17.32 46.28,19.1 JP-BT1.3
BT_USBD-
  Top 0.203: JP-BT1.2 47.3,17.78 45.57,16.05 45.57,14.63 45.06,14.12 U$3.USBD-
BT_VOL_DN  (via drill 0.33)
  Top 0.254: v44.98,11.68 44.94,11.72 U$3.GPIO10
  Bottom 0.254: SW_VDN.1 44.15,8.56 44.15,9.58 44.98,10.41 v44.98,11.68
BT_VOL_UP
  Top 0.254: SW_VUP.1 44.68,5.08 44.68,5.97 43.72,6.92 U$3.GPIO5
CHG_CHARGING
  Top 0.406: LED_CHG.1 67.31,47.14 62.26,42.09 AND-GATE.11
CHG_DONE
  Top 0.305: AND-GATE.3 55.47,42.75 57.15,44.42 LED_DONE.1
CHG_LOWBATT  (via drill 0.33, 0.6)  (1 unrouted)
  Top 0.254: v15.75,33.02 16.01,32.76 U1.24
  Top 0.406: AND-GATE.8 62.15,40.13 v62.23,40.21
  Bottom 0.203: 12.27,33.86 12.22,33.86
  Bottom 0.254: v15.75,33.02 14.91,33.86 12.27,33.86 | 12.22,33.86 AT_PINS.7
  Bottom 0.406: v62.23,40.21 LED_LB.1
CHG_PG  (via drill 0.33, 0.41)
  Top 0.152: NOT-GATE.6 52.63,38.79 52.3,39.12 50.65,39.12 v50.62,39.09 | AND-GATE.10 60.17,41.4 62.56,41.4 63.12,40.84 63.12,39.95 62.64,39.47 58.9,39.47 58.8,39.37 58.8,37.82 58.42,37.44 53.52,37.44 53.28,37.2 R6.1 | v51.89,35.15 52.29,34.76 PWR.C
  Top 0.203: PWR.C 53.34,34.6 53.34,34.57 54.43,33.48 v54.43,30.89 | v59.64,17.17 59.8,17.17 IC1.6
  Top 0.61: R6.1 53.19,36.41 PWR.C
  Bottom 0.152: v50.62,39.09 50.62,36.42 v51.89,35.15
  Bottom 0.203: v54.43,30.89 55.35,30.89 57.66,28.57 57.66,24.16 60.86,20.95 60.86,18.39 v59.64,17.17
CHG_STAT1  (via drill 0.33, 0.41)
  Top 0.152: v58.12,38.15 57.61,38.15 57.25,37.8 54.41,37.8 NOT-GATE.1 | v55.65,44.04 AND-GATE.1
  Top 0.203: IC1.8 61.44,16.84 v61.27,16.66 | R13.1 48.49,31.46 v48.49,32.72 48.49,32.9 CHRG/LBO.C 50.27,34.65 51.61,33.3 51.61,31.11 52.45,30.28 53.9,30.28 54.05,30.12 54.86,30.12 55.12,30.38 55.12,34.82 v56.08,35.79
  Bottom 0.152: v58.12,38.15 57.76,37.8 56.08,37.8 55.65,38.23 v55.65,44.04
  Bottom 0.203: v61.27,16.66 61.27,21.67 60.58,22.35 60.05,22.35 58.09,24.31 58.09,28.75 54.91,31.93 49.28,31.93 v48.49,32.72 | v56.08,35.79 56.08,36.12 v58.12,38.15
CHG_STAT2  (via drill 0.33, 0.41)
  Top 0.152: AND-GATE.5 v56.64,41.43 | v56.64,40.13 55.42,38.79 54.94,38.79 | 54.94,38.79 NOT-GATE.3 | v51.66,36.55 51.6,36.49 R5.1 | v54.99,39.32 54.94,38.79
  Top 0.203: v60.35,16.64 60.94,17.23 IC1.7
  Top 0.813: DONE.C R5.1
  Bottom 0.152: v56.64,41.43 v56.64,40.13 | v51.66,36.55 52.4,36.55 54.94,39.09 v54.99,39.32
  Bottom 0.203: 52.4,36.55 52.5,36.45 52.5,36.3 55.12,33.68 55.12,32.23 58.45,28.91 58.45,24.46 60.2,22.71 60.78,22.71 61.62,21.87 61.62,17.2 61.92,16.89 61.92,16.46 61.49,16.03 61.01,16.03 60.4,16.64 v60.35,16.64
CHG_VOUT  (via drill 0.5)
  Top 0.203: 59.36,22.61 59.65,22.61
  Top 0.305: 59.65,22.61 IC1.20 IC1.1 | IC1.1 59.44,21.51
  Top 1.016: 61.19,24.41 67.77,24.41 69.72,26.39 JP-BT3.1 69.72,25.61 C9.1 | 61.19,24.41 59.36,22.61 | 61.19,24.41 59.97,25.63 57.1,25.63 v56.41,24.94 55.93,24.46 v55.93,23.95
  Bottom 1.016: LED_CREE.1 54.1,16 54.1,22.35 55.7,23.95 v55.93,23.95 55.93,24.46 56.44,24.97
  pour Top: 59.13,20.55 59.99,20.55 60.71,21.26 60.71,22.45 60.58,22.58 60.3,22.94 59.03,22.66 58.88,20.8
CTS
  Top 0.406: FTDI.2 41.13,27.94 C1.2
DEV_EN  (via drill 0.41)
  Top 0.203: U$3.PWREN 37.87,23.59 37.52,23.95 35.81,23.95 34.72,25.04 28.32,25.04 v27.38,25.98
  Top 0.254: U1.13 21.19,38.12 22.55,36.75 23.67,36.75 v24.43,37.52
  Bottom 0.254: v24.43,37.52 24.43,34.59 24.59,34.44 30.53,34.44 31.57,33.4 31.57,29.03 30.91,28.37 28.19,28.37 27.38,27.56 v27.38,25.98
EXT_5V
  Bottom 1.27: EXT_PWR_JACK.1 72.59,36.7 72.59,33.96 71.65,33.02 JP-BT3.3
GND  (via drill 0.33, 0.36, 0.41, 0.51, 0.6, 0.9, 1.3)  (1 unrouted)
  Top 0.152: AND-GATE.7 54.36,40.08 54.33,39.62 | NOT-GATE.4 54.13,39.32
  Top 0.254: AT_PINS.6 U1.21
  Top 0.305: 54.13,39.32 54.28,39.47 AND-GATE.7 | 66.97,25.59 v67.79,26.42 | R1.2 8.87,48.13 v9.3,47.7
  Top 0.406: 30.35,37.95 v32.36,37.95 | TLC5917ID.1 v10.46,48.06 | U1.3 27.02,34.36 27.43,34.77 v27.43,35.31 | U1.5 26.78,35.96 v27.43,35.31 | v28.45,35.31 v27.43,35.31 | v35.94,38.02 37.12,38.02 R12.2 | v44.81,46.69 44.82,46.67 R25.2 44.82,42.82 R29.2 | U$3.GND2 27.3,22.12 v27.2,22.02
  Top 0.813: U$3.GND1 41.97,25.34 FTDI.1 | R14.2 R15.2 R24.2
  Top 1.27: MPU-6050.8 63.89,54.88 R15.2 | C9.2 v72.27,26.23 73.92,27.81 JP_GND.3
  Bottom 0.305: v59.38,24.46 60.17,24.46 v61.52,25.81 | v67.79,26.42 68.28,25.93 v72.27,26.23
  other vias: 1.27,6.35 3.81,6.35 3.81,17.78 1.27,17.78 33.96,6.43 32.49,6.38 32.41,3.86 25.4,1.27 36.09,3.91 25.45,5.13 52.43,40.36 52.98,41.1 64.52,3.3 64.52,5.59 71.12,17.53 73.89,6.6 40.92,18.69 40.89,17.02 9.19,46.58 9.12,45.42 49.73,21.06
  pour Top (rank 3): 47.22,26.49 61.16,26.49 65.35,26.42 66.24,26.42 67.26,25.53 67.23,23.01 67.31,22.94 69.57,22.94 69.72,23.09 69.72,24.56 70.05,24.89 71.6,24.89 72.11,25.4 72.11,26.16 72.87,26.92 74.45,26.92 75.08,26.29 75.08,-0.41 45.39,-0.41 45.39,24.71 46.89,26.16
  pour Top: 43.64,1.52 42.14,1.57 40.59,3.12 9.02,3.12 4.98,6.91 4.72,27.61 3.12,27.94 -0.33,27.94 -0.33,-0.51 43.64,-0.28
  pour Bottom (rank 3): 72.24,29.18 72.24,61.14 -0.18,61.14 -0.18,-0.15 41.86,-0.15 42.37,20.83 47.24,28.37 54.91,28.37 55.45,29.18
  pour Top: 20.75,2.97 20.75,3.91 23.9,7.06 24.38,7.54 30.51,7.54 36.25,7.54 41.81,1.98 21.74,1.98
  pour Top: 53.8,41.17 53.42,41.55 52.35,41.55 51.89,41.1 51.87,39.75 52.17,39.45 54.43,39.45 54.46,40.44 54.28,40.59 53.8,40.59
  pour Bottom: 62.97,0.08 62.97,6.55 63.86,7.44 66.34,7.44 69.34,10.44 69.34,24.56 73.48,28.7 75.67,28.7 77.34,27.03 77.34,0.08
  pour Bottom: 72.06,29.18 72.34,29.18 72.9,29.74 76.33,29.74 77.52,30.94 77.52,61.14 72.06,61.14
  pour Top: 64.72,36.86 64.72,37.87 65.18,38.33 66.29,39.95 67.79,39.95 68.12,39.62 68.12,38.71 69.27,37.57 70.28,37.57 71.5,36.35 71.5,34.54 71.3,34.34 68.99,34.34 66.75,36.58 65,36.58
  pour Top: 42.29,23.93 41.5,23.93 41.22,23.65 40.89,23.32 40.89,21.23 39.55,19.89 39.55,16 40.03,15.52 41.71,15.52 42.19,16 42.19,20.68 43.08,21.56 43.08,22.94 43.08,23.14
  pour Top: 8,45.11 8.26,44.86 11.96,44.86 11.96,49.02 9.53,49.02 8.13,47.62 8.13,45.06 8.15,45.03 8.15,44.98 8.18,44.96
  pour Bottom (rank 4): 62.18,26.49 48.21,26.49 45.42,23.7 45.42,-0.13 48.49,-0.13 77.5,-0.13 77.5,24.23 77.5,26.49
LED_CLK
  Top 0.305: TLC5917ID.3 13.01,47.85 13.03,47.88 13.03,47.98 13.82,48.77 14.73,48.77 15.39,48.11 20.42,48.11 22.71,48.11 J1.3
  Top 0.406: U1.17 16.43,39.22 16.43,40.92 17.02,41.5 18.59,41.5 20.27,43.18 20.27,47.95 20.42,48.11
LED_CREE  (via drill 0.41)
  Top 0.406: 43.59,39.9 45.01,38.48 45.01,28.93 52.16,21.78 Q1.1 | 43.59,39.9 43.51,39.98 v38.51,39.98 | v27.23,39.98 27.1,39.85 U1.9 | R29.1 44.64,40.96 43.59,39.9
  Bottom 0.406: v38.51,39.98 v27.23,39.98
LED_LE  (via drill 0.36)
  Top 0.254: 20.93,42.88 20.93,46.1 21.82,46.99 23.32,46.99 24.13,47.8 24.13,48.9 22.86,50.16 J1.1
  Top 0.305: TLC5917ID.4 14.28,47.85
  Top 0.406: 14.28,47.85 v14.25,47.88 | U1.16 18.79,40.74 20.93,42.88
  Bottom 0.305: J1.1 17.17,50.8 v14.25,47.88
LED_OE  (via drill 0.41)
  Top 0.305: TLC5917ID.13 14.22,50.88 v14.22,52.83 | v21.18,41.1 23.32,41.1 23.59,40.82 U1.10
  Bottom 0.305: v14.22,52.83 14.22,49.25 13.34,48.36 13.34,47.12 14.07,46.38 15.9,46.38 v21.18,41.1
LED_SDI  (via drill 0.36)
  Top 0.305: TLC5917ID.2 11.73,47.88 13.11,49.25 15.32,49.25 15.49,49.07 v16.71,49.07 | U1.15 19.59,40.49 24.13,45.03 24.13,46.89 25.4,48.16 J1.4
  Bottom 0.152: 23.82,49.53 21.79,49.53
  Bottom 0.305: J1.4 25.4,48.28 24.23,49.53 23.82,49.53 | 21.79,49.53 21.08,50.14 17.78,50.14 v16.71,49.07
MIC_L+  (via drill 0.36)
  Top 0.305: MIC_L.1 16.24,8.4 v16.2,8.43 | 29.31,11.73 U$3.MIC_L+ 27.78,11.72 27.18,11.12 v19.46,11.12
  Bottom 0.305: v16.2,8.43 16.87,8.43 v19.46,11.12
MIC_L-  (via drill 0.36)
  Top 0.305: MIC_L.2 14.24,7.83 v14.22,7.85 | 29.27,9.27 U$3.MIC_L- v19.13,9.32
  Bottom 0.305: v14.22,7.85 15.44,7.85 15.9,7.39 17.17,7.39 19.1,9.32 v19.13,9.32
MPU_SCL  (via drill 0.33, 0.36)
  Top 0.254: U1.28 21.19,30.17 v23.52,27.84 | v29.49,31.52 32.77,31.52 35.03,33.78 35.03,38.71 37.49,41.15 37.49,45.49
  Top 0.305: 37.49,45.49 40.77,48.77 45.14,48.77 48.39,52.02 v53.16,52.02
  Bottom 0.254: v23.52,27.84 24.49,27.84 28.17,31.52 v29.49,31.52 | 53.54,52.4 MPU-6050.5
  Bottom 0.305: v53.16,52.02 53.54,52.4
MPU_SDA  (via drill 0.33, 0.36)
  Top 0.254: 37.97,45.16 37.97,40.59 v36.63,39.24 | v28.85,30.63 33.22,30.63 35.89,33.3 v35.89,36.37 | v22.43,27.13 20.39,29.16 U1.27
  Top 0.305: 37.97,45.16 40.95,48.13 45.41,48.13 48.49,51.21 v55.14,51.21
  Bottom 0.254: MPU-6050.6 55.54,51.6 | v28.85,30.63 27.86,30.63 24.36,27.13 v22.43,27.13 | v35.89,36.37 35.03,37.24 35.03,38.73 35.53,39.24 v36.63,39.24
  Bottom 0.305: v55.14,51.21 55.54,51.6
N$1
  Top 0.406: U1.7 27.51,37.56 28.32,36.75
N$2
  Top 0.406: 28.32,39.15 27.53,38.36 U1.8
N$3  (via drill 0.33)
  Top 0.203: IC1.5 59.44,18.24 v59.44,18.11 | v57.66,20.68 55.89,20.68 RT1.1
  Bottom 0.203: v59.44,18.11 59.44,18.9 v57.66,20.68
N$5
  Top 0.406: R2.2 5.74,53.58 5.74,52.45 6.78,51.41 6.78,49.94 5.11,48.26 R22.2 6.99,45.98 6.99,44.42 15.42,44.42 15.52,44.53 15.52,46 TLC5917ID.5
N$6
  Top 0.406: R10.2 4.74,41.94 7.32,41.94 9.55,43.79 16.15,43.79 16.82,44.83 TLC5917ID.6
N$7
  Top 0.406: R16.2 7.24,35.56 7.98,36.3 7.98,41.07 10.01,43.05 17.14,43.05 18.09,44.04 TLC5917ID.7
N$8
  Top 0.406: R17.2 4.76,29.26 8.03,29.26 8.99,30.23 8.99,40.89 10.31,42.22 10.31,42.24 10.34,42.27 18.34,42.27 19.33,43.26 19.33,43.46 19.36,43.48 TLC5917ID.8
N$9
  Top 0.406: R23.2 19.36,54.42 TLC5917ID.9
  Top 0.61: R21.2 18.82,54.95 R23.2
N$10
  Top 0.406: TLC5917ID.10 18.09,49.68 18.87,48.9 19.63,48.9 20.37,49.63 20.37,53.31 21.34,54.28 23.58,54.28 R20.2
N$11  (via drill 0.36)
  Top 0.406: TLC5917ID.11 16.82,51.97 v17.58,52.73 | v29.06,54.84 30.44,54.84 R19.2
  Bottom 0.406: v17.58,52.73 28.35,52.73 28.93,53.31 28.93,54.71 v29.06,54.84
N$12  (via drill 0.36)
  Top 0.406: TLC5917ID.12 15.54,52.76 v16.46,53.67 | v27.64,53.75 35.98,53.75 R18.2
  Bottom 0.406: v16.46,53.67 27.56,53.67 v27.64,53.75
N$13
  Top 0.203: NTC_THERM.1 54.13,24.24 RT1.2 57.28,22.49 RT2.2
N$14  (via drill 0.36)
  Top 0.305: v27.13,7.19 26.72,6.78 26.72,5.54 27.73,4.52 U$3.SPKR_L- | v22.5,11.81 20.61,13.7 SPK_L.2
  Bottom 0.305: v22.5,11.81 v27.13,7.19
N$15
  Top 1.016: JSOLAR.2 73.05,11.66 D2.A
N$16
  Top 0.813: LED_BTCONN.2 R25.1
N$17
  Top 0.203: R4.2 56.96,19.09 58.18,20.31 IC1.2
  Top 0.61: R3.1 56.88,18.88 R4.2
N$18
  Top 0.203: IC1.12 64.55,19.31 R11.2
N$19
  Top 1.016: Q1.3 51.21,15.65 LED_CREE.2
N$20
  Top 0.61: R26.1 CHRG/LBO.A
N$21
  Top 0.813: DONE.A R27.1
N$22
  Top 0.406: R14.1 LED_DONE.2
N$23
  Top 0.61: PWR.A 53.19,31.23 R28.1
N$24
  Top 0.406: LED_LB.2 R15.1
N$26  (via drill 0.36)
  Top 0.305: SPK_R.2 9.44,23.86 v17.07,16.23 | v27.84,5.71 27.85,5.72 U$3.SPKR_R-
  Bottom 0.305: v17.07,16.23 27.58,5.71 v27.84,5.71
N$27  (via drill 0.36)
  Top 0.305: SPK_R.1 10.3,21.86 v17.14,15.01 | v27.84,3.43 27.94,3.32 U$3.SPKR_R+
  Bottom 0.305: v17.14,15.01 27.84,4.32 v27.84,3.43
N$30
  Top 0.406: LED_CHG.2 R24.1
N$56
  Top 0.305: TLC5917ID.15 11.73,52.22 11.33,52.63 9.72,52.63 R1.1
  Top 0.406: 11.77,50.86 TLC5917ID.15
N$57
  Top 0.406: R2.1 2.91,54.98 LED0-LF.2
N$58
  Top 0.61: LED4-RF.2 15.89,56.76 R21.1
N$59
  Top 0.406: R20.1 25.85,56.7 LED5-RM.2
N$60
  Top 0.406: R19.1 32.2,56.7 LED6-RR.2
N$61
  Top 0.406: R18.1 38.72,56.53 LED7-CS.2
N$62
  Top 0.406: R17.1 2.91,29.58 LED3-HR.2
N$63
  Top 0.406: R10.1 2.91,42.28 LED1-LM.2
N$64
  Top 0.406: R16.1 2.91,35.93 LED2-LR.2
N$65
  Top 0.406: R22.1 2.91,48.63 LED0-IL.2
N$66
  Top 0.61: R23.1 20.59,56.7 LED4-IR.2
N$80
  Top 0.406: U$2.VBUS 69.16,5.36
  Top 1.016: PWR_BUTTON.2 66.55,7.85 69.16,5.36 70.03,6.23 D2.C
PC2
  Top 0.203: U1.25 14.86,31.27 AT_PINS.8
PROG1
  Top 0.203: IC1.13 65.02,19.81 66.12,18.72 R7.2
RESET  (via drill 0.36)
  Top 0.254: C1.1 36.01,28.07 24.54,28.07 21.99,30.61 U1.29 21.99,34.35 v19.53,36.8
  Bottom 0.254: v19.53,36.8 19.53,37.77 22.73,40.97 22.73,45.59 J1.5
RXD  (via drill 0.6)
  Top 0.203: U$3.UART_TX 43.87,18.92 45.03,20.09 v45.03,27.53
  Top 0.254: U1.30 22.79,30.6 24.74,28.65 35,28.65 36.98,30.63 39.78,30.63 FTDI.4
  Bottom 0.203: v45.03,27.53 45.03,30.99 43,33.02 FTDI.4
STAT12
  Top 0.203: AND-GATE.6 57.35,40.79 | 57.35,40.79 AND-GATE.9 | AND-GATE.12 59.31,42.75 57.35,40.79
SW_BT_DISC
  Top 0.254: U1.2 26,33.68 32.18,33.68 33.35,34.85 33.35,38.66 32.23,39.78 32.23,41.17 31.55,41.86 SW_DISC.1
SW_CALL  (via drill 0.33)
  Top 0.254: U1.26 19.59,32.92 v20.22,33.55 | SW_CALL.1 35.28,39.75 34.62,39.09 34.62,33.98 32.79,32.16 v28.75,32.16
  Bottom 0.254: v20.22,33.55 20.22,33.25 22.43,31.04 27.08,31.04 28.19,32.16 v28.75,32.16
SW_TL  (via drill 0.33)
  Top 0.254: U1.32 26.75,31.27 28.32,32.84 32.74,32.84 34.21,34.31 34.21,39.04 33.4,39.85 33.4,45.54 v33.88,46.02
  Bottom 0.254: v33.88,46.02 33.88,46.13 SW_TL.1
SW_TR
  Top 0.254: U1.1 26.82,32.76 27.33,33.27 32.54,33.27 33.78,34.52 33.78,38.84 32.66,39.95 32.66,46.46 34.47,48.26 SW_TR.1
TXD  (via drill 0.6)
  Top 0.203: v43.79,27.15 43.79,21.09 U$3.UART_RX
  Top 0.254: FTDI.5 41.91,34.75 39.83,32.66 39.83,31.37 39.62,31.17 36.93,31.17 34.85,29.08 25.07,29.08 23.59,30.56 U1.31
  Bottom 0.203: FTDI.5 40.77,34.42 40.77,32.31 41.33,31.75 43.59,31.75 44.53,30.81 44.53,28.5 43.79,27.76 v43.79,27.15
VBATT  (1 unrouted)
  Top 0.203: IC1.16 IC1.15
  pour Top: 62.18,21.79 62.18,20.8 62.92,20.07 67.39,20.07 67.64,20.42 67.64,23.37 67.49,23.55 63.42,23.55 63.07,22.07 62.51,22.07
  pour Top: 67.44,23.55 73.41,23.55 74.07,22.89 74.07,21.79 73.69,21.41 66.78,21.41 66.67,21.51 66.67,23.16 67.06,23.55
VCHG  (via drill 0.33, 1.3)
  Top 0.203: IC1.19 60.94,22.38 v61.54,22.99
  Top 0.305: IC1.9 61.94,16.35 61.54,15.95 59.64,15.95 58.82,15.13 C4.1 59.18,14.91
  Top 0.762: R3.2 58.69,15.04
  Top 1.016: 58.69,15.04 C4.1
  other vias: 62.48,22.99 58.24,18.39 58.24,19.23 61.98,14.48
  pour Top (rank 2): 60.81,21.23 62.13,21.23 62.18,21.29 62.18,22.3 62.28,22.4 63.02,22.4 63.22,22.61 63.22,23.27 62.99,23.5 62.87,23.62 61.34,23.62 60.86,23.14 60.86,22.66 60.6,22.4 60.6,21.39 60.76,21.23
  pour Top (rank 2): 59,20.04 59.74,20.04 59.97,20.04 60.07,19.94 60.07,19.18 59.97,19.08 58.95,19.08 58.85,18.97 58.85,16.26 58.75,16.15 58.75,16.1 58.85,16 58.72,15.88 58.27,15.88 57.66,16.48 57.66,16.84 57.66,19.3 58.14,19.79 58.39,20.04
  pour Bottom: 56.64,3.96 63.58,10.9 66.93,10.67 67.59,11.33 67.54,17.98 62.99,23.8 61.09,23.85 56.39,17.75 54.84,12.32 54.89,3.96
  pour Bottom: 53.26,5.84 53.26,2.34 54.41,1.19 57.35,1.19 58.27,2.11 58.27,6.17 57.53,6.91 54.33,6.91
  pour Top: 57.86,14.2 59.92,14.2 61.16,12.95 62.74,12.95 63.75,13.97 63.75,15.49 62.94,16.31 62.87,16.31 62.03,17.14 62.03,16.48 61.49,15.95 59.79,15.95 58.93,16.81 58.55,16.81 58.42,16.69 58.34,16.76 57.99,16.76 57.86,16.64 57.86,14.63
VIN
  Top 1.676: 61.42,35.36 61.52,35.26 | 61.52,35.26 65.71,35.26 | 61.52,35.26 61.62,35.36 62.81,35.36 62.81,35.28 62.79,35.31 | JP-BT3.2 68.78,30.48 65.28,33.98 65.28,34.8 65.71,35.23 | 65.71,35.26 65.71,35.28 65.73,35.31 65.73,35.28 65.71,35.26 | C7.1 65.43,35.51 65.71,35.23 | 65.71,35.23 65.71,35.26
  pour Top: 61.65,36.2 66.12,36.2 66.29,36.02 66.29,34.32 68.71,31.9 70.74,31.9 71.78,30.86 71.78,30 70.99,29.21 70.92,29.13 68.38,29.13 64.36,33.15 64.36,34.16 64.24,34.29 61.54,34.29 60.99,34.85 60.99,35.76 61.42,36.2
~CHG_PG  (via drill 0.33)
  Top 0.203: NOT-GATE.2 v56.36,38.43 | v58.9,43.38 AND-GATE.13
  Bottom 0.203: v56.36,38.43 58.9,40.69 v58.9,43.38
~CHG_STAT1  (via drill 0.33)
  Top 0.152: 54.25,42.04 AND-GATE.4 52.98,42.09 v52.58,42.49 | NOT-GATE.7 v51.99,38.43
  Bottom 0.152: v51.99,38.43 52.73,39.17 53.7,39.17 54.13,39.6 54.13,42.19 53.72,42.6 52.68,42.6 v52.58,42.49
~CHG_STAT2
  Top 0.152: AND-GATE.2 51.87,43.38 51.46,42.98 51.46,40.23 51.94,39.75 52.5,39.75 NOT-GATE.5

### Text on the board
tNames: VDD / GND / INT / SYNC / SCL / SDA / VIO / CLK | AND Gate
bNames: Hail-met v1 / Ben Wang, Brian Margosian, Brian Daniels, / Alex Jaeckel, Patrick Hayes / EECS 473 / University of Michigan / (C) 2014